# Altium project atmel328p_eeg_rev1.PrjPcb
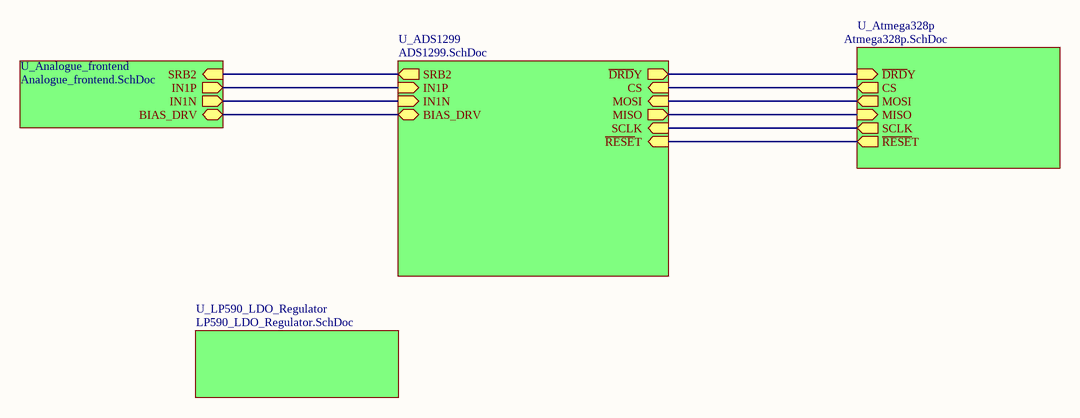
[diagram p0: Top.SchDoc]
5 sheets, 45 parts. Net scope: hierarchical (ports join the sheet entries above them; power ports are global).
Board file: PCB1.PcbDoc
Sheets:
  Top.SchDoc
    U_ADS1299 = ADS1299.SchDoc
    U_Analogue_frontend = Analogue_frontend.SchDoc
    U_LP590_LDO_Regulator = LP590_LDO_Regulator.SchDoc
    U_Atmega328p = Atmega328p.SchDoc

## Sheet Top.SchDoc
size A

### Sub-sheets
U_ADS1299 = ADS1299.SchDoc: MISO (out), CS (in), SCLK (in), MOSI (in), SRB2 (out), IN1P (in), IN1N (in), ~{DRD}Y (out), BIAS_DRV (bidir), ~{RESE}T (in)
U_Analogue_frontend = Analogue_frontend.SchDoc: BIAS_DRV (bidir), IN1N (out), IN1P (out), SRB2 (in)
U_Atmega328p = Atmega328p.SchDoc: CS (out), MOSI (out), MISO (in), SCLK (out), ~{DRD}Y (in), ~{RESE}T (out)
U_LP590_LDO_Regulator = LP590_LDO_Regulator.SchDoc: no entries

### Nets
CS: sheet U_ADS1299/CS, sheet U_Atmega328p/CS
~{DRD}Y: sheet U_ADS1299/~{DRD}Y, sheet U_Atmega328p/~{DRD}Y
MISO: sheet U_ADS1299/MISO, sheet U_Atmega328p/MISO
MOSI: sheet U_ADS1299/MOSI, sheet U_Atmega328p/MOSI
~{RESE}T: sheet U_ADS1299/~{RESE}T, sheet U_Atmega328p/~{RESE}T
SCLK: sheet U_ADS1299/SCLK, sheet U_Atmega328p/SCLK
Sdjbdjahdb: sheet U_ADS1299/SRB2, sheet U_Analogue_frontend/SRB2
NetC19_2: sheet U_ADS1299/BIAS_DRV, sheet U_Analogue_frontend/BIAS_DRV
NetC23_2: sheet U_ADS1299/IN1P, sheet U_Analogue_frontend/IN1P
NetC24_2: sheet U_ADS1299/IN1N, sheet U_Analogue_frontend/IN1N

## Sheet ADS1299.SchDoc
size A
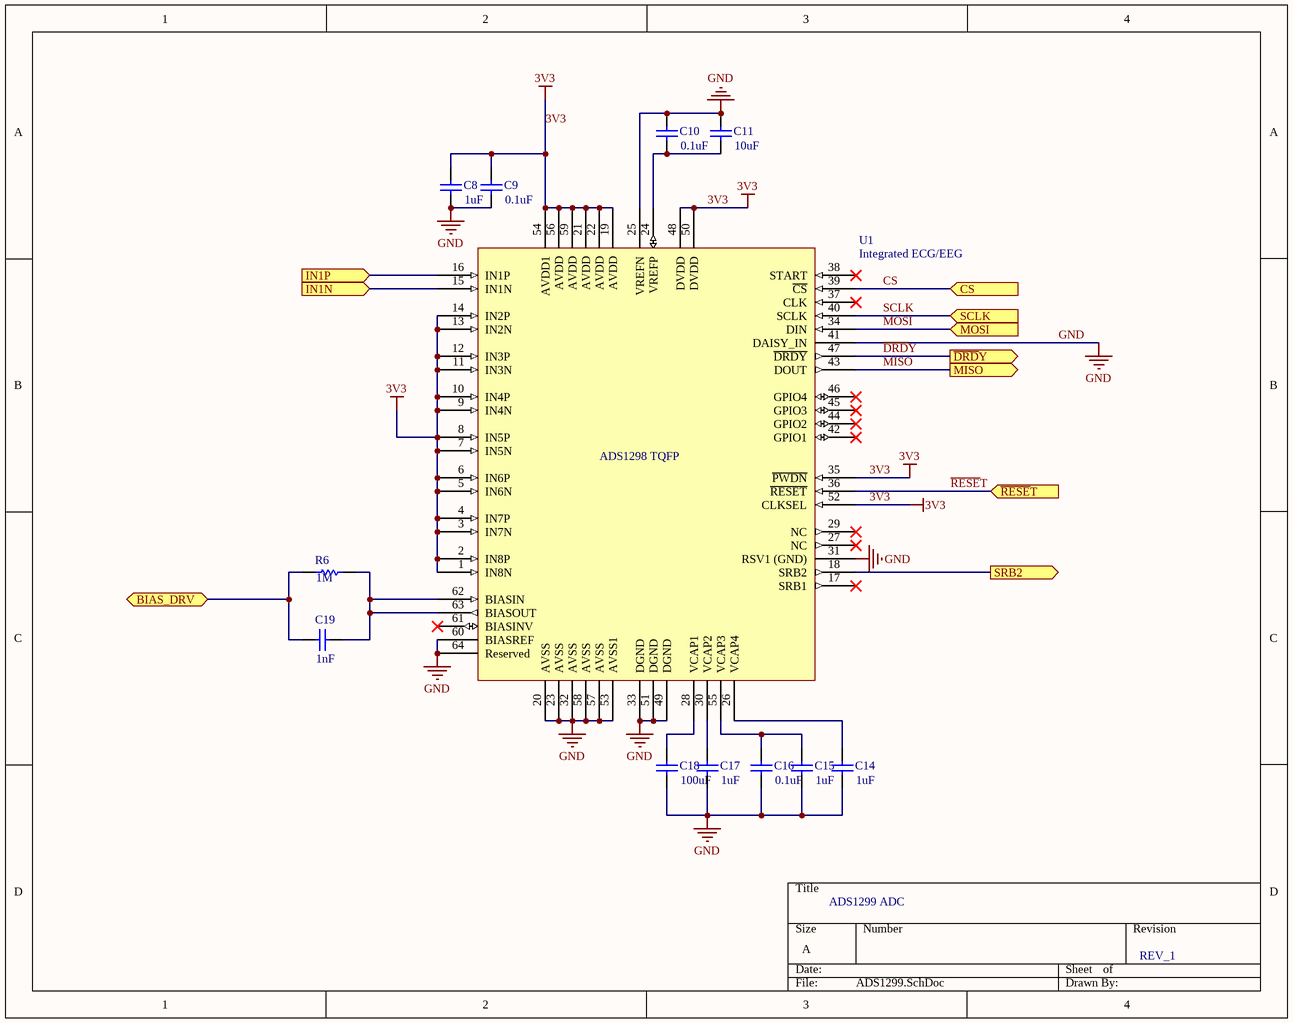
[diagram p1: ADS1299.SchDoc]

### Parts
C8  value 1uF  [1608[0603]]  (hidden comment: Cap)
C9  value 0.1uF  [1608[0603]]  (hidden comment: Cap)
C10  value 0.1uF  [1608[0603]]  (hidden comment: Cap)
C11  value 10uF  [1608[0603]]  (hidden comment: Cap)
C14  value 1uF  [1608[0603]]  (hidden comment: Cap)
C15  value 1uF  [1608[0603]]  (hidden comment: Cap)
C16  value 0.1uF  [1608[0603]]  (hidden comment: Cap)
C17  value 1uF  [1608[0603]]  (hidden comment: Cap)
C18  value 100uF  [1608[0603]]  (hidden comment: Cap)
C19  value 1nF  [1608[0603]]  (hidden comment: Cap)
R6  value 1M  [1608[0603]]  (hidden comment: Res)
U1  Integrated ECG/EEG  [TQFP-PT64_N]

### Ports
BIAS_DRV (bidir), CS (in), IN1N (in), IN1P (in), MISO (out), MOSI (in), SCLK (in), SRB2 (out), ~{DRD}Y (out), ~{RESE}T (in)

### Nets
3V3: C8.2 C9.2 U1.1(IN8N) U1.2(IN8P) U1.3(IN7N) U1.4(IN7P) U1.5(IN6N) U1.6(IN6P) U1.7(IN5N) U1.8(IN5P) U1.9(IN4N) U1.10(IN4P) U1.11(IN3N) U1.12(IN3P) U1.13(IN2N) U1.14(IN2P) U1.19(AVDD) U1.21(AVDD) U1.22(AVDD) U1.35(~{PWDN}) U1.48(DVDD) U1.50(DVDD) U1.52(CLKSEL) U1.54(AVDD1) U1.56(AVDD) U1.59(AVDD)
GND: C8.1 C9.1 C10.2 C11.2 C14.1 C15.1 C16.1 C17.1 C18.1 U1.20(AVSS) U1.23(AVSS) U1.25(VREFN) U1.31(RSV1_(GND)) U1.32(AVSS) U1.33(DGND) U1.41(DAISY_IN) U1.49(DGND) U1.51(DGND) U1.53(AVSS1) U1.57(AVSS) U1.58(AVSS) U1.60(BIASREF) U1.64(Reserved)
CS: U1.39(~{CS}) ; port CS
~{DRD}Y: U1.47(~{DRDY}) ; port ~{DRD}Y
MISO: U1.43(DOUT) ; port MISO
MOSI: U1.34(DIN) ; port MOSI
~{RESE}T: U1.36(~{RESET}) ; port ~{RESE}T
SCLK: U1.40(SCLK) ; port SCLK
Sdjbdjahdb: U1.18(SRB2) ; port SRB2
NetC10_1: C10.1 C11.1 U1.24(VREFP)
NetC14_2: C14.2 U1.26(VCAP4)
NetC15_2: C15.2 C16.2 U1.55(VCAP3)
NetC17_2: C17.2 U1.30(VCAP2)
NetC18_2: C18.2 U1.28(VCAP1)
NetC19_1: C19.1 R6.1 U1.62(BIASIN) U1.63(BIASOUT)
NetC19_2: C19.2 R6.2 ; port BIAS_DRV
NetC23_2: U1.16(IN1P) ; port IN1P
NetC24_2: U1.15(IN1N) ; port IN1N

Not connected (* = marked no-connect by the designer): U1 17(SRB1)* 27(NC)* 29(NC)* 37(CLK)* 38(START)* 42(GPIO1)* 44(GPIO2)* 45(GPIO3)* 46(GPIO4)* 61(BIASINV)*

### Notes on the sheet
- ADS1299 ADC
- REV_1
- (in symbol ADS1298-TQFP) ADS1298 TQFP

### Library data of the parts
C8-C11 C14-C19 = Cap: Capacitor; Published: 8-Jun-2000; LatestRevisionDate: 17-Jul-2002; LatestRevisionNote: Re-released for DXP Platform.; PackageReference: RAD-0.3; Publisher: Altium Limited; PackageDescription: Radial Cap, Thru-Hole; 2 Leads; 0.3 in Pin Spacing
R6 = Res1: Resistor; Published: 8-Jun-2000; LatestRevisionDate: 17-Jul-2002; LatestRevisionNote: Re-released for DXP Platform.; PackageReference: AXIAL-0.3; Publisher: Altium Limited; PackageDescription: Axial Device, Thru-Hole; 2 Leads; 0.3 in Pin Spacing
U1 = ADS1298-TQFP

## Sheet Analogue_frontend.SchDoc
size A
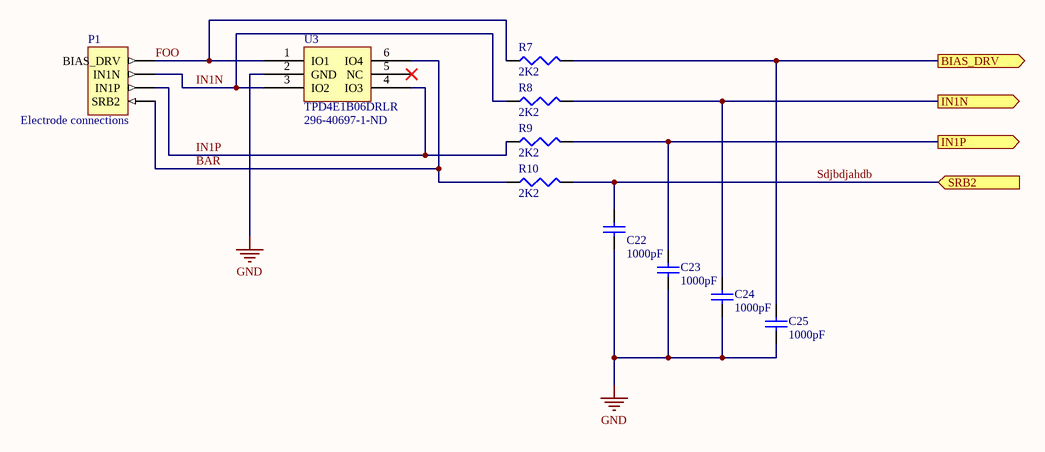
[diagram p2: Analogue_frontend.SchDoc]

### Parts
C22  value 1000pF  [1608[0603]]  (hidden comment: Cap Semi)
C23  value 1000pF  [1608[0603]]  (hidden comment: Cap Semi)
C24  value 1000pF  [1608[0603]]  (hidden comment: Cap Semi)
C25  value 1000pF  [1608[0603]]  (hidden comment: Cap Semi)
P1  Electrode connections  [HDR1X4]
R7  value 2K2  [J1-0603]  (hidden comment: Res3)
R8  value 2K2  [J1-0603]  (hidden comment: Res3)
R9  value 2K2  [J1-0603]  (hidden comment: Res3)
R10  value 2K2  [J1-0603]  (hidden comment: Res3)
U3  TPD4E1B06DRLR  Supplier Part Number 1: 296-40697-1-ND  [SOT50P185X60-6N]

### Ports
BIAS_DRV (out), IN1N (out), IN1P (out), SRB2 (in)

### Nets
GND: C22.1 C23.1 C24.1 C25.1 U3.2(GND)
BAR: P1.1(SRB2) R10.1 U3.6(IO4)
FOO: P1.4(BIAS_DRV) R7.1 U3.1(IO1)
IN1N: P1.3(IN1N) R8.1 U3.3(IO2)
IN1P: P1.2(IN1P) R9.1 U3.4(IO3)
Sdjbdjahdb: C22.2 R10.2 ; port SRB2
NetC19_2: C25.2 R7.2 ; port BIAS_DRV
NetC23_2: C23.2 R9.2 ; port IN1P
NetC24_2: C24.2 R8.2 ; port IN1N

Not connected (* = marked no-connect by the designer): U3 5(NC)*

### Library data of the parts
C22-C25 = Cap Semi: Capacitor (Semiconductor SIM Model); Published: 8-Jun-2000; LatestRevisionDate: 29-May-2009; LatestRevisionNote: IPC-7351 Footprint Added.; PackageReference: C1206; Publisher: Altium Limited; PackageDescription: Chip Capacitor
P1 = Header 4: Header, 4-Pin; LatestRevisionDate: 17-Jul-2002; LatestRevisionNote: Re-released for DXP Platform.; Publisher: Altium Limited
R7-R10 = Res3: Resistor; Published: 8-Jun-2000; LatestRevisionDate: 29-May-2009; LatestRevisionNote: IPC-7351 Footprint Added.; PackageReference: J1-0603; Publisher: Altium Limited; PackageDescription: Chip Resistor
U3 = TPD4E1B06DRLR: TVS DIODE 5.5VWM 14.5VC 6SOT; Manufacturer: Texas Instruments; Bidirectional Channels: 4; Voltage - Reverse Standoff (Typ): 5.5V (Max); Voltage - Breakdown (Min): 7V; Voltage - Clamping (Max) @ Ipp: 14.5V (Typ); Current - Peak Pulse (10/1000µs): 3A (8/20µs); Power - Peak Pulse: 45W; Power Line Protection: No; Supplier 1: Digi-Key; Manufacturer Part Number: TPD4E1B06DRLR; RoHS: RoHS Compliant By Exemption; Category: Circuit Protection; Stock 1: 2244; Pricing 1: 1=0.67, 10=0.585, 25=0.5168, 100=0.4504, 250=0.39204, 500=0.33372, 750=0.2916, 1000=0.2673 (USD); Packaging: Cut Tape (CT); Type: Steering (Rail to Rail); Unidirectional Channels: -; Applications: General Purpose; Capacitance @ Frequency: -; Operating Temperature: -40°C ~ 125°C (TA); Mounting Type: Surface Mount; Package / Case: SOT-563, SOT-666; Supplier Device Package: SOT-6; ComponentLink1URL: http://www.ti.com/lit/ds/symlink/tpd4e1b06.pdf; ComponentLink1Description: http://www.ti.com/lit/ds/symlink/tpd4e1b06.pdf

## Sheet LP590_LDO_Regulator.SchDoc
size A
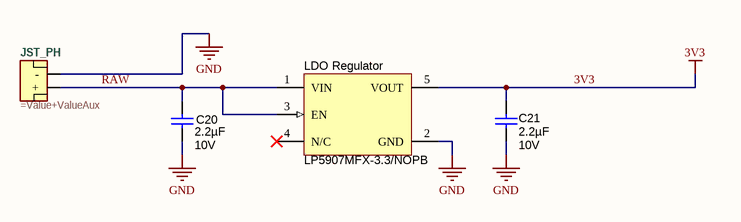
[diagram p3: LP590_LDO_Regulator.SchDoc]

### Parts
C20  ValueDisplayed: 2.2µF  Value2: 10V  [1608[0603]]  (hidden comment: GRM188R71A225KE15D)
C21  ValueDisplayed: 2.2µF  Value2: 10V  [1608[0603]]  (hidden comment: GRM188R71A225KE15D)
JST_PH  (no value)  [S2B-EH]
LDO_Regulator  LP5907MFX-3.3/NOPB  [DBV005_N]

### Nets
3V3: C21.2 LDO_Regulator.5(VOUT)
GND: C20.1 C21.1 JST_PH.2(-) LDO_Regulator.2(GND)
RAW: C20.2 JST_PH.1(+) LDO_Regulator.1(VIN) LDO_Regulator.3(EN)

Not connected (* = marked no-connect by the designer): LDO_Regulator 4(N/C)*

### Library data of the parts
C20 = GRM188R71A225KE15D: CAP, CERM, 2.2uF, 10V, +/-10%, X7R, 0603; Manufacturer: MuRata; Polarized: N; CompType: Capacitor; U/M: EA; Cap_F: 0.0000022; Tolerance_%: 10; ESR_Ohm: 0.009; Value1: 0.009 ohm; TaMin_C: -55; TaMax_C: 125; Cap_Case: 0603; SymbolVersion: 2008-07-09; Value: 2.2uF; PartNumber: GRM188R71A225KE15D; PackageReference: 0603; RoHS: Y; VDC_V: 10; MountType: SMT; Technology: Ceramic; TempCo: X7R; Published: 2008-06-19; Publisher: Texas Instruments; LatestRevisionDate: 2014-07-08; ComponentLink1Description: Datasheet link; ComponentLink1URL: http://search.murata.co.jp/Ceramy/PnsearchViewAction.do?HnOFG=ON&HnNFG=ON&SEL_CNT=50&sLang=en&sKey=GRM188R71A225KE15D&x=9&y=9&search=startwith; Supplier 1: Digi-Key; Supplier Part Number 1: 490-4520-1-ND; Supplier 2: Mouser; Supplier Part Number 2: 81-GRM188R71A225KE15; Supplier 3: Farnell; Supplier Part Number 3: 1797012
C21 = GRM188R71A225KE15D: CAP, CERM, 2.2 µF, 10 V, +/- 10%, X7R, 0603; Manufacturer: MuRata; Polarized: N; CompType: Capacitor; Value: 2.2uF; U/M: EA; Cap_F: 0.0000022; Tolerance_%: 10; ESR_ohm: 0.009; Value1: 0.009 ohm; TaMin_C: -55; TaMax_C: 125; Cap_Case: 0603; SymbolVersion: 2008-07-09; PartNumber: GRM188R71A225KE15D; PackageReference: 0603; RoHS: Y; VDC_V: 10; MountType: SMT; Technology: Ceramic; TempCo: X7R; Published: 2008-06-19; Publisher: Texas Instruments; LatestRevisionDate: 2014-07-21; ComponentLink1Description: Datasheet link; ComponentLink1URL: http://search.murata.co.jp/Ceramy/PnsearchViewAction.do?HnOFG=ON&HnNFG=ON&SEL_CNT=50&sLang=en&sKey=GRM188R71A225KE15D&x=9&y=9&search=startwith; Supplier 1: Digi-Key; Supplier Part Number 1: 490-4520-1-ND; Supplier 2: Mouser; Supplier Part Number 2: 81-GRM188R71A225KE15; Supplier 3: Farnell; Supplier Part Number 3: 1797012
JST_PH = JST-2: =Description
LDO_Regulator = LP5907MFX-3.3/NOPB: ULTRA LOW-NOISE, 250-mA LINEAR REGULATOR FOR RF AND ANALOG CIRCUITS REQUIRES NO BYPASS CAPACITOR, DBV0005A; Manufacturer: Texas Instruments; Alternate Manufacturer: None; CompType: IC; SymbolCreator: a0799628; U/M: EA; PackageReference: DBV0005A; Publisher: Texas Instruments; PartNumber: LP5907MFX-3.3/NOPB; RoHS: Y; ComponentLink1Description: Datasheet Link; ComponentLink1URL: http://www.ti.com/lit/ds/symlink/lp5907.pdf; SymbolVersion: 2014-03-21; MountType: SMT; LatestRevisionDate: 2014-07-28

## Sheet Atmega328p.SchDoc
size A
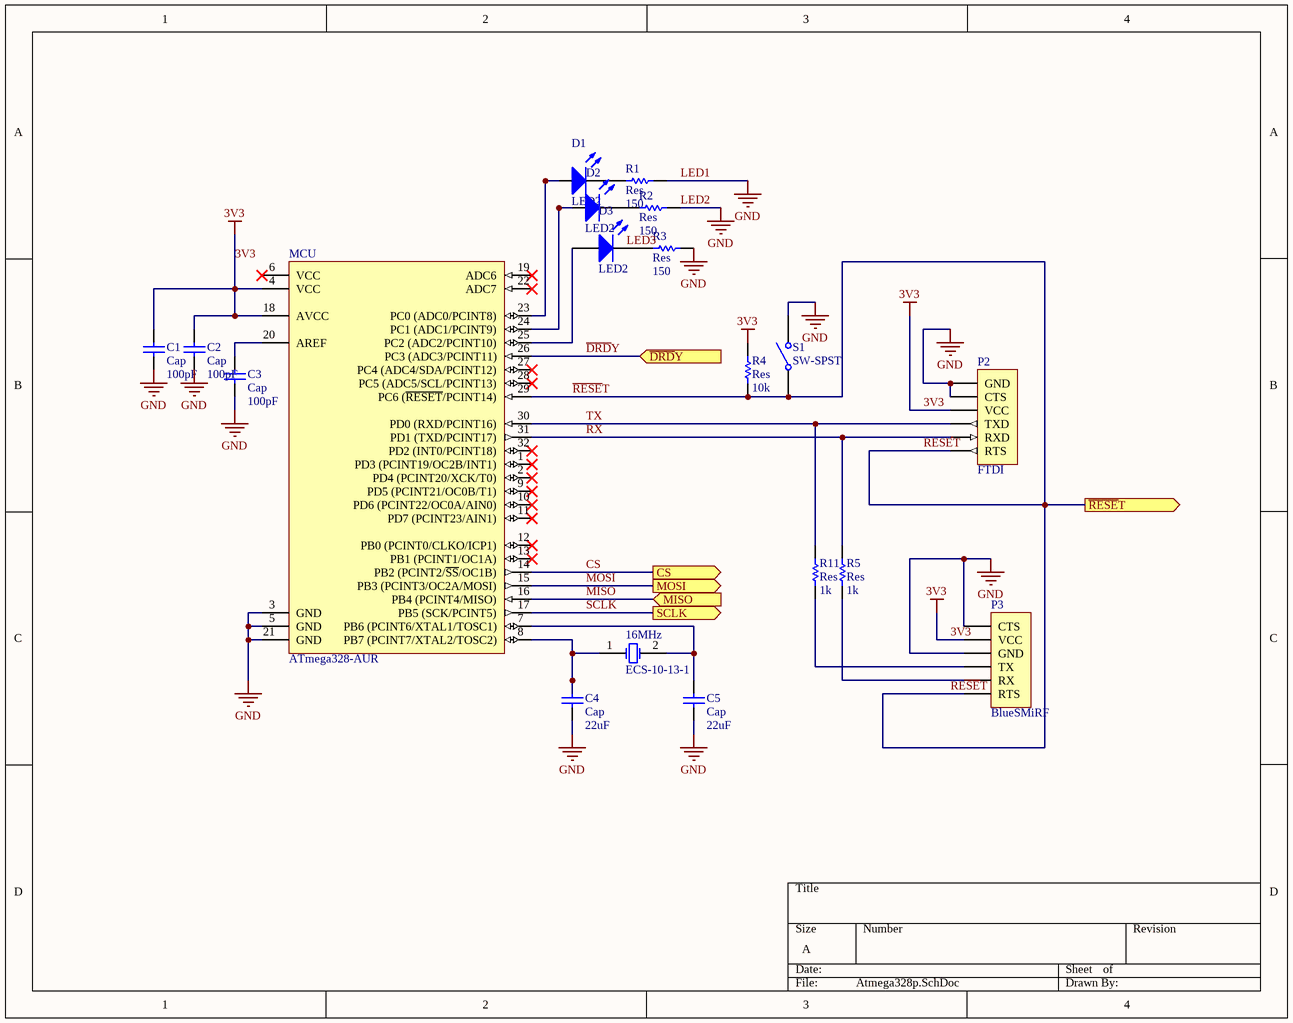
[diagram p4: Atmega328p.SchDoc]

### Parts
16MHz  ECS-10-13-1  [HC-49U]
C1  Cap  C1: 100pF  [1608[0603]]
C2  Cap  C1: 100pF  [1608[0603]]
C3  Cap  C1: 100pF  [1608[0603]]
C4  Cap  value 22uF  [1608[0603]]
C5  Cap  value 22uF  [1608[0603]]
D1  LED2  [3.2X1.6X1.1]
D2  LED2  [3.2X1.6X1.1]
D3  LED2  [3.2X1.6X1.1]
MCU  ATmega328-AUR  [32A_N]
P2  FTDI  [HDR1X6]
P3  BlueSMiRF  [HDR1X6]
R1  Res  value 150  [1608[0603]]
R2  Res  value 150  [1608[0603]]
R3  Res  value 150  [1608[0603]]
R4  Res  value 10k  [J1-0603]
R5  Res  value 1k  [1608[0603]]
R11  Res  value 1k  [1608[0603]]
S1  SW-SPST  [SPST-2]

### Ports
CS (out), MISO (in), MOSI (out), SCLK (out), ~{DRD}Y (in), ~{RESE}T (out)

### Nets
3V3: C1.2 C2.2 MCU.4(VCC) MCU.18(AVCC) P2.3(VCC) P3.2(VCC) R4.2
GND: C1.1 C2.1 C3.1 C4.1 C5.1 MCU.3(GND) MCU.5(GND) MCU.21(GND) P2.1(GND) P2.2(CTS) P3.1(CTS) P3.3(GND) R1.1 R2.1 R3.1 S1.2(NO)  [also labelled LED1, LED2]
CS: MCU.14(PB2_(PCINT2/~{SS}/OC1B)) ; port CS
~{DRD}Y: MCU.26(PC3_(ADC3/PCINT11)) ; port ~{DRD}Y
MISO: MCU.16(PB4_(PCINT4/MISO)) ; port MISO
MOSI: MCU.15(PB3_(PCINT3/OC2A/MOSI)) ; port MOSI
~{RESE}T: MCU.29(PC6_(~{RESET}/PCINT14)) P2.6(RTS) P3.6(RTS) R4.1 S1.1(COMMON) ; port ~{RESE}T
RX: MCU.31(PD1_(TXD/PCINT17)) P2.5(RXD) R5.1
SCLK: MCU.17(PB5_(SCK/PCINT5)) ; port SCLK
TX: MCU.30(PD0_(RXD/PCINT16)) P2.4(TXD) R11.1
Net16MHz_1: 16MHz.1(OSC1) C4.2 MCU.8(PB7_(PCINT7/XTAL2/TOSC2))
Net16MHz_2: 16MHz.2(OSC2) C5.2 MCU.7(PB6_(PCINT6/XTAL1/TOSC1))
NetC3_2: C3.2 MCU.20(AREF)
NetD1_1: D1.1(A) MCU.23(PC0_(ADC0/PCINT8))
NetD1_2: D1.2(K) R1.2
NetD2_1: D2.1(A) MCU.24(PC1_(ADC1/PCINT9))
NetD2_2: D2.2(K) R2.2
NetD3_1: D3.1(A) MCU.25(PC2_(ADC2/PCINT10))
NetD3_2: D3.2(K) R3.2
NetP3_4: P3.4(TX) R11.2
NetP3_5: P3.5(RX) R5.2

Not connected (* = marked no-connect by the designer): MCU 1(PD3_(PCINT19/OC2B/INT1))* 2(PD4_(PCINT20/XCK/T0))* 6(VCC)* 9(PD5_(PCINT21/OC0B/T1))* 10(PD6_(PCINT22/OC0A/AIN0))* 11(PD7_(PCINT23/AIN1))* 12(PB0_(PCINT0/CLKO/ICP1))* 13(PB1_(PCINT1/OC1A))* 19(ADC6)* 22(ADC7)* 27(PC4_(ADC4/SDA/PCINT12))* 28(PC5_(ADC5/SCL/PCINT13))* 32(PD2_(INT0/PCINT18))*

### Notes on the sheet
- Labels drawn without touching a wire or pin: LED3

### Library data of the parts
16MHz = ECS-10-13-1: Crystal Oscillator; Published: 17-Jul-2002; DatasheetDocument: 18-Apr-2000; PackageReference: HC-49U; Publisher: Altium Limited; ComponentLink1Description: Manufacturer Link; ComponentLink1URL: http://www.ecsxtal.com/; ComponentLink2Description: Datasheet; ComponentLink2URL: http://www.ecsxtal.com/pdf2/HC49U.PDF
C1-C5 = Cap: Capacitor; Published: 8-Jun-2000; LatestRevisionDate: 17-Jul-2002; LatestRevisionNote: Re-released for DXP Platform.; PackageReference: RAD-0.3; Publisher: Altium Limited; PackageDescription: Radial Cap, Thru-Hole; 2 Leads; 0.3 in Pin Spacing
D1-D3 = LED2: Typical RED, GREEN, YELLOW, AMBER GaAs LED; Published: 8-Jun-2000; LatestRevisionDate: 17-Jul-2002; LatestRevisionNote: Re-released for DXP Platform.; PackageVersion: Feb-2002; PackageReference: 3.2X1.6X1.1; Publisher: Altium Limited; PackageDescription: SM LED; 2 Flat Leads
MCU = ATmega328-AUR: 8-bit AVR Microcontroller, 32KB Flash, 1KB EEPROM, 2KB SRAM, 32-pin TQFP, Industrial Grade (-40°C to 85°C); Published: 1-Apr-2010; DatasheetVersion: revA, Jan-2010; PackageVersion: revB, Oct-2001; PackageReference: 32A; Publisher: Altium Limited; PackageDescription: 32-Lead, 7x7x1.0 mm Body, 0.8mm Lead Pitch, Thin Profile Plastic Quad Flat Package (TQFP); Supplier 1: Digi-Key; Supplier Part Number 1: ATMEGA328-AUR-ND; Supplier 2: Mouser; Supplier Part Number 2: 556-ATMEGA328-AUR; Code_JEDEC: MS-026-ABA; ComponentLink1Description: Manufacturer Link; ComponentLink1URL: http://www.atmel.com/products/avr/default.asp?; ComponentLink2Description: ATmega48A/48PA/88A/88PA/168A/168PA/328/328P Datasheet; ComponentLink2URL: http://www.atmel.com/dyn/resources/prod_documents/8271.pdf; ComponentLink3Description: ATmega48A/48PA/88A/88PA/168A/168PA/328/328P Summary; ComponentLink3URL: http://www.atmel.com/dyn/resources/prod_documents/8271S.pdf; ComponentLink4Description: Atmel.com Home; ComponentLink4URL: http://www.atmel.com
P2 P3 = Header 6: Header, 6-Pin; LatestRevisionDate: 17-Jul-2002; LatestRevisionNote: Re-released for DXP Platform.; Publisher: Altium Limited
R1-R5 R11 = Res1: Resistor; Published: 8-Jun-2000; LatestRevisionDate: 17-Jul-2002; LatestRevisionNote: Re-released for DXP Platform.; PackageReference: AXIAL-0.3; Publisher: Altium Limited; PackageDescription: Axial Device, Thru-Hole; 2 Leads; 0.3 in Pin Spacing
S1 = SW-SPST: Single-Pole, Single-Throw Switch; Published: 24-Mar-1999; LatestRevisionDate: 17-Jul-2002; LatestRevisionNote: Re-released for DXP Platform.; PackageReference: SPST-2; Publisher: Altium Limited; PackageDescription: Switch; 2 Leads

## Nets that join several sheets
3V3: ADS1299 (26 pins), LP590_LDO_Regulator (C21.2 LDO_Regulator.5), Atmega328p (7 pins)
GND: ADS1299 (23 pins), Analogue_frontend (5 pins), LP590_LDO_Regulator (C20.1 C21.1 JST_PH.2 LDO_Regulator.2), Atmega328p (16 pins)
CS: ADS1299 (U1.39), Atmega328p (MCU.14)
~{DRD}Y: ADS1299 (U1.47), Atmega328p (MCU.26)
MISO: ADS1299 (U1.43), Atmega328p (MCU.16)
MOSI: ADS1299 (U1.34), Atmega328p (MCU.15)
NetC19_2: ADS1299 (C19.2 R6.2), Analogue_frontend (C25.2 R7.2)
NetC23_2: ADS1299 (U1.16), Analogue_frontend (C23.2 R9.2)
NetC24_2: ADS1299 (U1.15), Analogue_frontend (C24.2 R8.2)
~{RESE}T: ADS1299 (U1.36), Atmega328p (5 pins)
SCLK: ADS1299 (U1.40), Atmega328p (MCU.17)
Sdjbdjahdb: ADS1299 (U1.18), Analogue_frontend (C22.2 R10.2)